# EAGLE design Grove - Collision Sensor V0.9b (EAGLE 6.1)
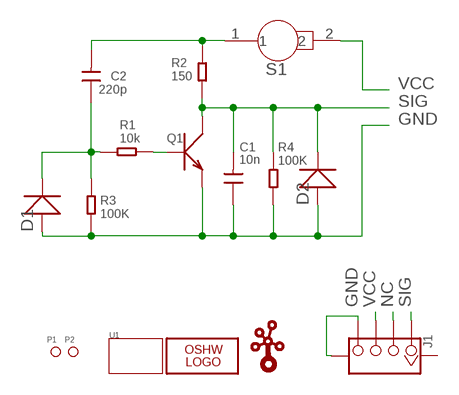
[diagram p0: schematic, sheet 1]

## Parts
C1  10n  C-0603  [0603]
C2  220p  C-0603  [0603]
D1  D1N4148-SMD  [DO-35-SMD]
D2  D1N4148-SMD  [DO-35-SMD]
J1  TWIG-4P-2.0-SMD-FEMALE-REINFORCE'DD'  [4P-SMD-2.0]
LOGO1  LOGO-OSHW-6MILX0200-NT  [OSHW_6X200_NOTEXT]
P1  PAD-MARK  [ROUND-MARK-0.635]
P2  PAD-MARK  [ROUND-MARK-0.635]
Q1  TRANSISTOR-NPN-SOT23''  [SOT23]
R1  10k  R-0603  [0603]
R2  150  R-0603  [0603]
R3  100K  R-0603  [0603]
R4  100K  R-0603  [0603]
S1  SENSOR-COLLISION  [2P-ROUND-D5.4MM]
U1  TWIG-1U  [1U-DIM-W/-DRILL]
U$2  LOGO-TWIG  [TWIGLOGO]

## Nets
GND: C1.1 D1.A(+) D2.A(+) J1.4 J1.SS2 Q1.2(E) R3.2 R4.2
N$1: C2.2 R2.1 S1.1
N$2: C2.1 D1.C(-) R1.2 R3.1
N$3: Q1.1(B) R1.1
NC: J1.2
SIG: C1.2 D2.C(-) J1.1 Q1.3(C) R2.2 R4.1
VCC: J1.3 S1.2
Unconnected: J1.SS1

## Library data of the parts
C1 C2 = Discrete:C*: Ceramic Capacitors
D1 D2 = Discrete:D*
J1 = Connector:TWIG-4P-2.0-SMD-FEMALE-REINFORCE
LOGO1 = Logo:LOGO-OSHW-6MIL
P1 P2 = Discrete:PAD-MARK
Q1 = Discrete:TRANSISTOR-NPN*: NPN audion
R1-R4 = Discrete:R*
S1 = Discrete:SENSOR-COLLISION
U1 = Module:TWIG
U$2 = Logo:LOGO-TWIG

## Board
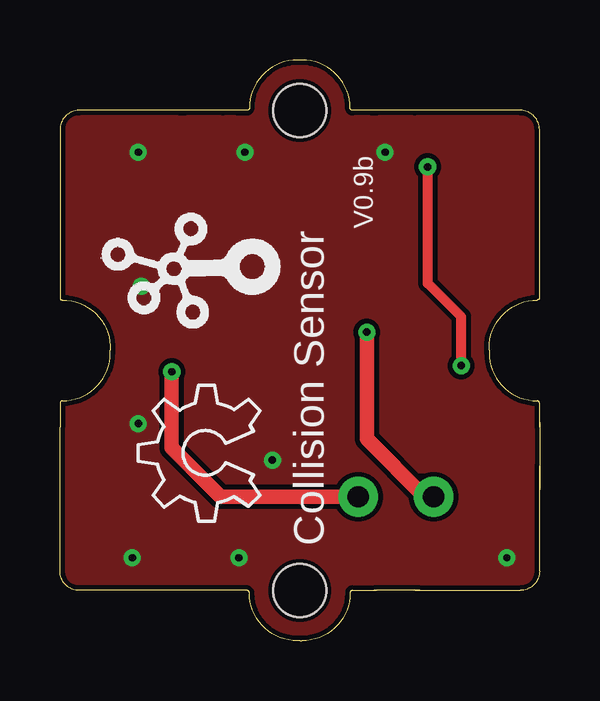
[diagram p1: board, top side]
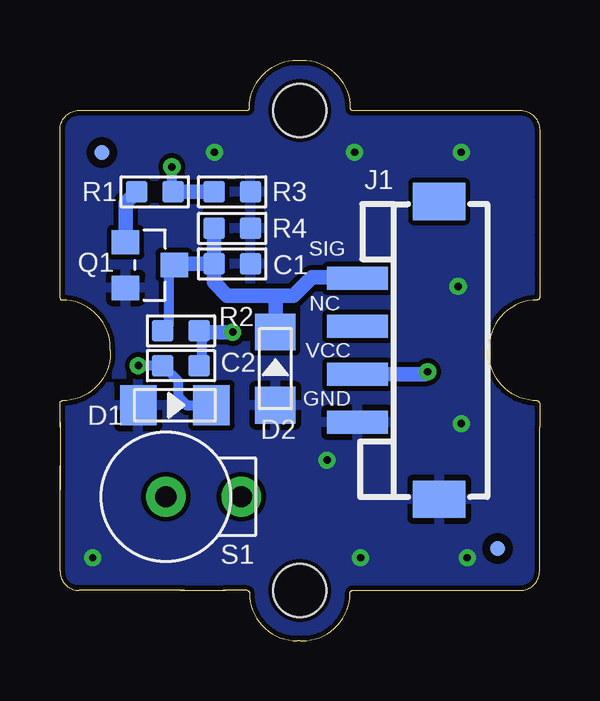
[diagram p2: board, bottom side, seen from below]

Size 20 x 24.2 mm. Coordinates in mm from the lower left corner, seen from the top.
Copper layers (1*16): Top 0.035mm / dielectric 1.5mm / Bottom 0.035mm
Design rules: minimum track width 6mil, minimum drill 12mil, track to track 8mil, track to pad 8mil, pad to pad 8mil, via to via 8mil, smd to smd 8mil, copper to edge 8mil, drill to drill 8mil, minimum pad ring 10mil, minimum via ring 8mil, stop-mask expansion 4mil, vias tented up to drill 25mil, thermal gap 10mil

### Footprints (pad centres in the part's own frame; a part is rotated, then mirrored left to right if it is on the bottom)
0603 = smd 0.889 x 0.889: 1 -0.762,0; 2 0.762,0
DO-35-SMD = smd 1.524 x 1.676: A 1.524,0; C -1.524,0
4P-SMD-2.0 = smd 0.965 x 2.54: 1 -3,0; 2 -1,0; 3 1,0; 4 3,0 | smd 1.55 x 2.184: SS1 -6.2,3.4; SS2 6.2,3.4
ROUND-MARK-0.635 = smd 0.635 x 0.635: P$1 0,0
SOT23 = smd 1.016 x 1.143: 1 -0.95,-1.016; 2 0.95,-1.016; 3 0,1.016
2P-ROUND-D5.4MM = drill 0.889 pad 1.651: 1 0,0; 2 -3.15,0
1U-DIM-W/-DRILL = hole 2.2: 0,-10; 0,10

### Placement (x,y rotation side)
C1  12.82,15.71 180 bottom
C2  14.95,11.46 0 bottom
D1  15.21,9.81 180 bottom
D2  11.02,11.34 270 bottom
J1  7.59,12.1 270 bottom
LOGO1  8.35,4.99 90 top
P1  1.74,3.84 0 bottom
P2  18.26,20.36 0 bottom
Q1  16.25,15.66 270 bottom
R1  16.05,18.7 0 bottom
R2  14.95,12.91 180 bottom
R3  12.82,18.7 0 bottom
R4  12.82,17.18 0 bottom
S1  15.59,6 180 bottom
U1  10,12.1 0 bottom
U$2  8.22,15.53 90 top

### Tracks (layer width: path | path; a pad name or v marks a point on that pad's centre or on a via)
GND  (via drill 0.3)
  other vias: 13.56,20.36 7.71,20.36 3.27,20.36 3.4,14.77 3.27,9.05 8.86,7.53 18.64,3.46 7.46,3.46 3.01,3.46
  pour Bottom: 22.7,25.69 -2.83,25.69 -2.83,-1.87 22.7,-1.87
  pour Top: 22.7,25.69 -2.83,25.69 -2.83,-1.87 22.7,-1.87
N$1  (via drill 0.3)
  Top 0.61: S1.1 15.21,6 12.79,8.42 v12.79,12.86
  Bottom 0.406: 14.06,11.59 14.06,12.79 R2.1 14.14,12.86 14.06,12.86
  Bottom 0.61: v12.79,12.86 14.06,12.86 | 14.06,11.59 C2.2
N$2  (via drill 0.3)
  Top 0.406: v15.33,19.74 15.33,14.89 16.73,13.5 v16.73,11.46
  Bottom 0.406: v15.33,19.74 15.33,18.7 R1.2 | v16.73,11.46 C2.1 15.08,10.83 15.08,10.2 14.7,9.81 D1.C 13.56,9.81
  Bottom 0.61: R1.2 R3.1 13.56,18.7
N$3
  Bottom 0.61: Q1.1 17.26,18.25 R1.1
SIG
  Bottom 0.406: Q1.3 15.23,15.5 15.46,15.27 15.46,13.17 R2.2
  Bottom 0.61: R4.1 C1.2 | C1.2 15.18,15.71 Q1.3 | C1.2 13.58,14.94 13.02,14.39 11.02,14.39 | 11.02,14.39 10.25,14.39 9.49,15.15 7.59,15.15 | 7.46,15.15 7.59,15.15 | 7.59,15.15 J1.1 | D2.C 11.02,14.39
VCC  (via drill 0.3)
  Top 0.61: v4.67,11.21 4.67,8.04 6.7,6 S1.2
  Bottom 0.61: J1.3 4.78,11.1 v4.67,11.21

### Text on the board
tPlace: V0.9b | Collision Sensor
bPlace: SIG | NC | VCC | GND